# EAGLE design PCB-BI8-1x4SERCP_v08-16 (EAGLE 7.5.0)

## Sheet 1 of 2
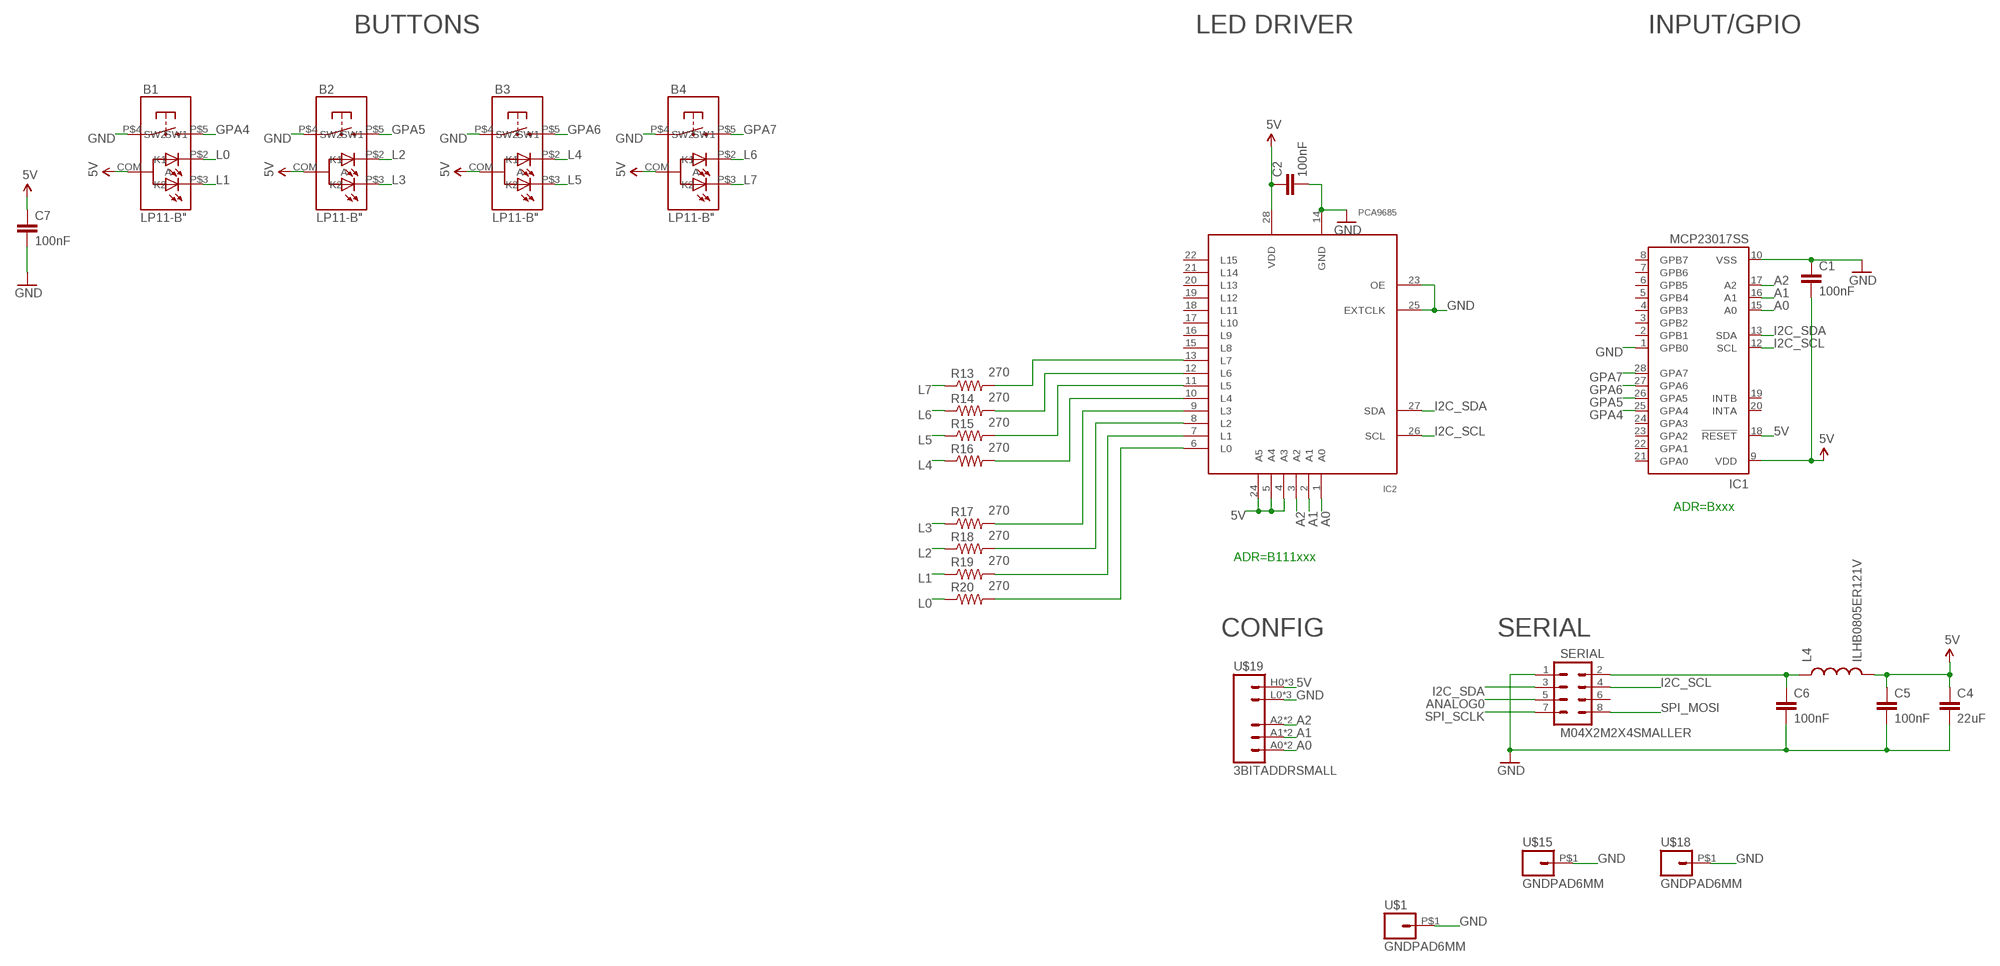
[diagram p0: schematic, sheet 1]

### Parts
B1  LP11-B"  [LP11]
B2  LP11-B"  [LP11]
B3  LP11-B"  [LP11]
B4  LP11-B"  [LP11]
C1  100nF  CAP0603-CAP  [0603-CAP]
C2  100nF  CAP0603-CAP  [0603-CAP]
C4  22uF  CAP0805  [0805]
C5  100nF  CAP0603-CAP  [0603-CAP]
C6  100nF  CAP0603-CAP  [0603-CAP]
C7  100nF  CAP0603-CAP  [0603-CAP]
IC1  MCP23017SS  [SSOP28]
IC2  PCA9685  [TSSOP28]
L4  ILHB0805ER121V  INDUCTOR0805  [0805]
R13  270  RESISTOR0603-RES  [0603-RES]
R14  270  RESISTOR0603-RES  [0603-RES]
R15  270  RESISTOR0603-RES  [0603-RES]
R16  270  RESISTOR0603-RES  [0603-RES]
R17  270  RESISTOR0603-RES  [0603-RES]
R18  270  RESISTOR0603-RES  [0603-RES]
R19  270  RESISTOR0603-RES  [0603-RES]
R20  270  RESISTOR0603-RES  [0603-RES]
SERIAL  M04X2M2X4SMALLER  [M2X4SMALLER]
U$1  GNDPAD6MM  [3.2MMPAD6MM]
U$15  GNDPAD6MM  [3.2MMPAD6MM]
U$18  GNDPAD6MM  [3.2MMPAD6MM]
U$19  3BITADDRSMALL  [3BITADDR_SMALL]

### Nets
5V [Power]: B1.COM(A) B2.COM(A) B3.COM(A) B4.COM(A) C1.2 C2.1 C4.1 C5.1 C7.1 IC1.9(VDD) IC1.18(!RESET) IC2.4(A3) IC2.5(A4) IC2.24(A5) IC2.28(VDD) L4.2 U$19.H0(VCC) U$19.H1(VCC) U$19.H2(VCC)
A0: IC1.15(A0) IC2.1(A0) U$19.A0 U$19.AS0(A0)
A1: IC1.16(A1) IC2.2(A1) U$19.A1 U$19.AS1(A1)
A2: IC1.17(A2) IC2.3(A2) U$19.A2 U$19.AS2(A2)
ANALOG0: SERIAL.5
GND [Power]: B1.P$4(SW1) B2.P$4(SW1) B3.P$4(SW1) B4.P$4(SW1) C1.1 C2.2 C4.2 C5.2 C6.2 C7.2 IC1.1(GPB0) IC1.10(VSS) IC2.14(GND) IC2.23(OE) IC2.25(EXTCLK) SERIAL.1 U$1.P$1 U$15.P$1 U$18.P$1 U$19.L0(GND) U$19.L1(GND) U$19.L2(GND)
GPA4: B1.P$5(SW2) IC1.25(GPA4)
GPA5: B2.P$5(SW2) IC1.26(GPA5)
GPA6: B3.P$5(SW2) IC1.27(GPA6)
GPA7: B4.P$5(SW2) IC1.28(GPA7)
I2C_SCL: IC1.12(SCL) IC2.26(SCL) SERIAL.4
I2C_SDA: IC1.13(SDA) IC2.27(SDA) SERIAL.3
L0: B1.P$2(K1) R20.1
L1: B1.P$3(K2) R19.1
L2: B2.P$2(K1) R18.1
L3: B2.P$3(K2) R17.1
L4: B3.P$2(K1) R16.1
L5: B3.P$3(K2) R15.1
L6: B4.P$2(K1) R14.1
L7: B4.P$3(K2) R13.1
N$1 [Power]: C6.1 L4.1 SERIAL.2
N$4: IC2.13(L7) R13.2
N$5: IC2.12(L6) R14.2
N$7: IC2.11(L5) R15.2
N$9: IC2.10(L4) R16.2
N$10: IC2.9(L3) R17.2
N$11: IC2.8(L2) R18.2
N$12: IC2.7(L1) R19.2
N$19: IC2.6(L0) R20.2
SPI_MOSI: SERIAL.8
SPI_SCLK: SERIAL.7
Unconnected: IC1.2(GPB1) IC1.3(GPB2) IC1.4(GPB3) IC1.5(GPB4) IC1.6(GPB5) IC1.7(GPB6) IC1.8(GPB7) IC1.19(INTB) IC1.20(INTA) IC1.21(GPA0) IC1.22(GPA1) IC1.23(GPA2) IC1.24(GPA3) IC2.15(L8) IC2.16(L9) IC2.17(L10) IC2.18(L11) IC2.19(L12) IC2.20(L13) IC2.21(L14) IC2.22(L15) SERIAL.6

### Notes on the sheet
- BUTTONS | LED DRIVER | INPUT/GPIO
- ADR=Bxxx
- ADR=B111xxx
- CONFIG | SERIAL

## Sheet 2 of 2

## Library data of the parts
B1-B4 = SKAARHOJ:LP11-B
C1 C2 C4-C7 = SparkFun:CAP: Capacitor Standard 0603 ceramic capacitor, and 0.1" leaded capacitor.
IC1 = microchip:MCP23017: http://ww1.microchip.com/downloads/en/DeviceDoc/21952a.pdf Source: http://ww1.microchip.com/downloads/en/DeviceDoc/21952a.pdf; MF: MICROCHIP; MPN: MCP23017-E/SS; OC_FARNELL: 1467674; OC_NEWARK: 31K2960
IC2 = wsmith:PCA9685
L4 = SparkFun:INDUCTOR: Inductors Basic Inductor/Choke - 0603 and 1206. Footprints are not proven and vary greatly between part numbers.
R13-R20 = SparkFun:RESISTOR: Resistor Basic schematic elements and footprints for 0603, 1206, and PTH resistors.
SERIAL = SKAARHOJ:M04X2
U$1 U$15 U$18 = SKAARHOJ:GNDPAD
U$19 = SKAARHOJ:3BITADDR

## Net classes
0 default: width 0.203 mm, drill 0.406 mm, clearance 0.203 mm
1 Power: width 0.406 mm, drill 0.61 mm, clearance 0.203 mm

## Board
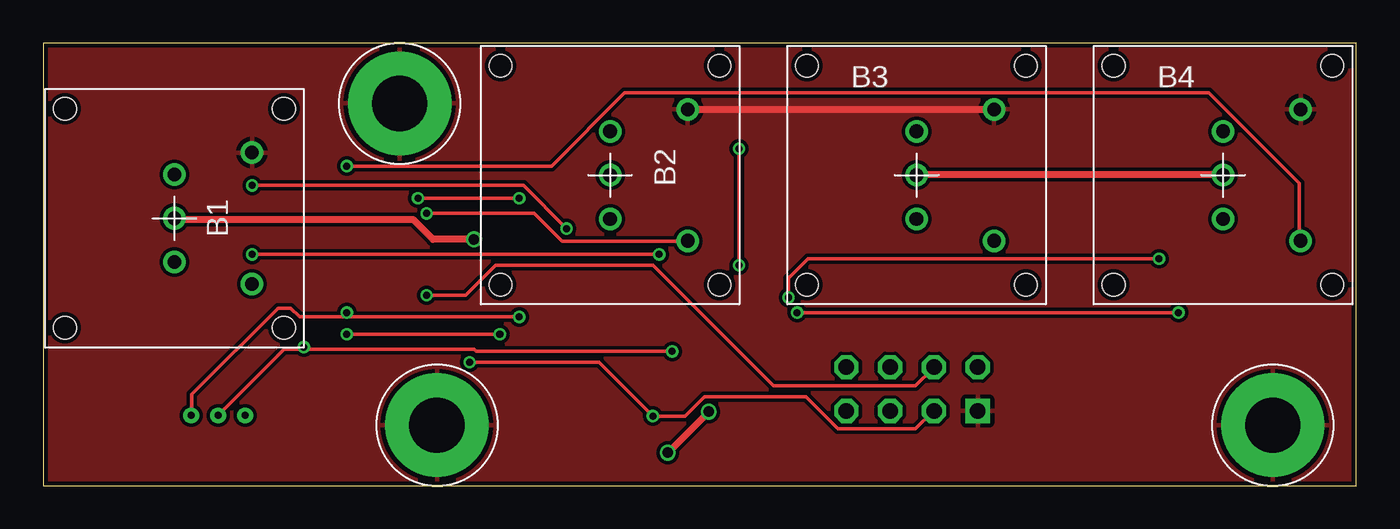
[diagram p1: board, top side]
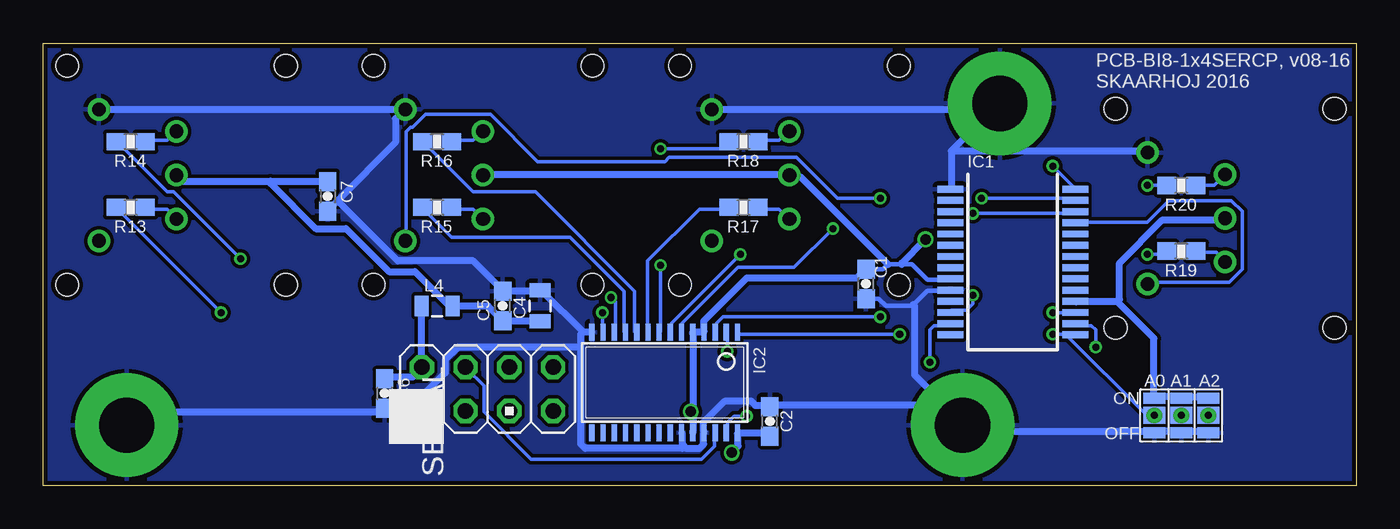
[diagram p2: board, bottom side, seen from below]

Size 76.2 x 25.66 mm. Coordinates in mm from the lower left corner, seen from the top.
Outline: 0,0 76.2,0 76.2,25.66 0,25.66 0,0
Copper layers (1*16): Top 0.035mm / dielectric 1.5mm / Bottom 0.035mm
Design rules "Fusion_eagle_rule_v1.1": minimum track width 6mil, minimum drill 12mil, track to track 6mil, track to pad 6mil, pad to pad 6mil, via to via 6mil, smd to smd 0mil, copper to edge 10mil, drill to drill 10mil, minimum pad ring 10mil, minimum via ring 6mil, stop-mask expansion 2mil, vias tented up to drill 100mil, thermal gap 10mil

### Footprints (pad centres in the part's own frame; a part is rotated, then mirrored left to right if it is on the bottom)
LP11 = drill 0.8: COM 0,0; P$2 0,2.54; P$3 0,-2.54; P$4 4.5,3.81; P$5 4.5,-3.81 | hole 1.3: -6.35,6.35; 6.35,6.35; 6.35,-6.35; -6.35,-6.35
0603-CAP = smd 1.1 x 1: 1 -0.85,0; 2 0.85,0
0805 = smd 0.8 x 1.2: 1 -0.9,0; 2 0.9,0
SSOP28 = smd 0.4 x 1.5: 1 -4.225,-3.625; 2 -3.575,-3.625; 3 -2.925,-3.625; 4 -2.275,-3.625; 5 -1.625,-3.625; 6 -0.975,-3.625; 7 -0.325,-3.625; 8 0.325,-3.625; 9 0.975,-3.625; 10 1.625,-3.625; 11 2.275,-3.625; 12 2.925,-3.625; 13 3.575,-3.625; 14 4.225,-3.625; 15 4.225,3.625; 16 3.575,3.625; 17 2.925,3.625; 18 2.275,3.625; 19 1.625,3.625; 20 0.975,3.625; 21 0.325,3.625; 22 -0.325,3.625; 23 -0.975,3.625; 24 -1.625,3.625; 25 -2.275,3.625; 26 -2.925,3.625; 27 -3.575,3.625; 28 -4.225,3.625
TSSOP28 = smd 0.305 x 0.991: 1 -4.225,-2.918; 2 -3.575,-2.918; 3 -2.925,-2.918; 4 -2.275,-2.918; 5 -1.625,-2.918; 6 -0.975,-2.918; 7 -0.325,-2.918; 8 0.325,-2.918; 9 0.975,-2.918; 10 1.625,-2.918; 11 2.275,-2.918; 12 2.925,-2.918; 13 3.575,-2.918; 14 4.225,-2.918; 15 4.225,2.918; 16 3.575,2.918; 17 2.925,2.918; 18 2.275,2.918; 19 1.625,2.918; 20 0.975,2.918; 21 0.325,2.918; 22 -0.325,2.918; 23 -0.975,2.918; 24 -1.625,2.918; 25 -2.275,2.918; 26 -2.925,2.918; 27 -3.575,2.918; 28 -4.225,2.918
0603-RES = smd 1.1 x 1: 1 -0.85,0; 2 0.85,0
M2X4SMALLER = drill 0.9 square: 1 -1.27,3.81 | drill 0.9 octagon: 2 1.27,3.81; 3 -1.27,1.27; 4 1.27,1.27; 5 -1.27,-1.27; 6 1.27,-1.27; 7 -1.27,-3.81; 8 1.27,-3.81
3.2MMPAD6MM = drill 3.2 pad 6: P$1 0,0
3BITADDR_SMALL = drill 0.4: A0 -1.565,0; A1 0,0; A2 1.565,0 | smd 1.27 x 1: AS0 -1.565,0; AS1 0,0; AS2 1.565,0 | smd 1.27 x 0.635: H0 -1.565,1; H1 0,1; H2 1.565,1; L0 -1.565,-1; L1 0,-1; L2 1.565,-1

### Placement (x,y rotation side)
B1  7.62,15.5 0 top
B2  32.9,18 0 top
B3  50.68,18 0 top
B4  68.46,18 0 top
C1  28.45,11.69 90 bottom
C2  34.04,3.71 90 bottom
C4  47.37,10.42 90 bottom
C5  49.53,10.42 90 bottom
C6  56.39,5.34 270 bottom
C7  59.69,16.77 270 bottom
IC1  19.94,12.96 270 bottom
IC2  40.13,5.98 180 bottom
L4  53.34,10.42 0 bottom
R13  71.12,16.14 180 bottom
R14  71.12,19.95 180 bottom
R15  53.34,16.14 180 bottom
R16  53.34,19.95 180 bottom
R17  35.56,16.14 180 bottom
R18  35.56,19.95 180 bottom
R19  10.16,13.59 180 bottom
R20  10.16,17.41 180 bottom
SERIAL  50.42,5.59 90 bottom
U$1  20.69,22.16 0 top
U$15  22.85,3.5 0 top
U$18  71.35,3.5 0 top
U$19  10.16,4.07 0 bottom

### Tracks (layer width: path | path; a pad name or v marks a point on that pad's centre or on a via)
5V  (via drill 0.61)
  Top 0.406: B3.COM 50.75,18.03 68.38,18.03 B4.COM | v38.62,4.28 v36.25,1.91 | v25,14.28 22.62,14.28 21.5,15.4 7.62,15.4 B1.COM
  Bottom 0.254: C1.2 27.47,12.54 27.18,12.83 26.38,12.83 25.78,12.83 24.89,11.94 23.61,11.94 IC1.9
  Bottom 0.406: C4.1 49.5,9.53 C5.1 49.62,9.65 50.38,10.4 52.38,10.4 L4.2 52.62,10.4 54.62,12.4 56.12,12.4 58.62,14.9 60.38,14.9 63,17.53 63,17.66 | 63,17.66 68.12,17.66 68.38,17.91 B4.COM | 63,17.66 59.75,17.66 C7.1 | U$19.H2 8.62,5.16 10.12,5.16 U$19.H1 10.25,5.16 11.62,5.16 U$19.H0 11.75,5.28 11.75,8.53 13.88,10.65 | 13.88,10.65 16.25,10.65 IC1.18 | B1.COM 7.62,15.4 11.25,15.4 13.75,12.9 13.75,10.78 13.88,10.65 | C2.1 34.12,2.91 34.25,3.03 35.88,3.03 IC2.28 35.88,2.91 35.88,2.28 v36.25,1.91 | 38.5,4.28 38.5,8.78 IC2.5 38.38,8.9 37.88,8.9 IC2.4 37.88,9.03 37.88,9.53 35.38,12.03 29,12.03 28.5,12.53 C1.2 | 38.5,4.28 38.5,3.16 IC2.24 | v38.62,4.28 38.5,4.28 | 27.18,12.83 32.25,17.91 32.88,17.91 B2.COM 33,18.03 50.62,18.03 B3.COM | v25,14.28 26.38,12.9 26.38,12.83
A0  (via drill 0.41)
  Top 0.203: v17.62,8.78 v26.5,8.78
  Bottom 0.203: 11.75,4.03 U$19.AS0 11.75,4.16 12.25,4.16 16.88,8.78 | v26.5,8.78 35.88,8.78 IC2.1 | 16.88,8.78 16.38,8.78 IC1.15 16.88,8.78 | 16.88,8.78 v17.62,8.78
A1  (via drill 0.41)
  Top 0.203: v36.5,7.78 25.12,7.78 25,7.91 15.12,7.91 | 15.12,7.91 14,7.91 10.25,4.16 U$19.AS1 | 15.12,7.91 v15.12,8.03
  Bottom 0.203: v36.5,7.78 36.5,8.78 IC2.2 | 10.25,4.03 U$19.AS1 | v15.12,8.03 15.12,9.03 15.38,9.28 16.25,9.28 IC1.16
A2  (via drill 0.41)
  Top 0.203: 17.62,9.78 14.88,9.78 14.38,10.28 13.62,10.28 8.62,5.28 8.62,4.16 U$19.AS2 | 17.62,9.78 v27.62,9.78 | 17.62,9.78 v17.62,10.03
  Bottom 0.203: v27.62,9.78 36.75,9.78 37.12,9.4 37.12,8.9 IC2.3 | 8.62,4.03 U$19.AS2 | v17.62,10.03 16.38,10.03 IC1.17
GND
  Top 0.406: B2.P$4 37.5,21.78 55.12,21.78 B3.P$4
  Bottom 0.254: C1.1 27.73,10.84 27.3,10.42 25.78,10.42 25.71,10.49 24.89,11.31 23.59,11.31 IC1.10
  Bottom 0.406: 23.38,19.53 20.75,22.16 U$1.P$1 21.38,21.78 37.38,21.78 B2.P$4 | 23.38,19.53 23.5,19.41 23.5,17.28 IC1.1 | B1.P$4 12.12,19.41 23.25,19.41 23.38,19.53 | U$18.P$1 71.25,3.53 70.5,4.28 56.5,4.28 C6.2 56.38,4.41 54.25,4.41 SERIAL.1 54.12,4.53 54.12,5.28 52.88,6.53 52.88,7.28 52.12,8.03 45,8.03 | 59.12,16.53 55.75,19.91 55.75,21.28 55.25,21.78 B3.P$4 55.5,21.78 72.88,21.78 B4.P$4 | 59.12,16.53 59.62,16.03 C7.2 | 44.88,8.9 44.38,8.9 IC2.14 | 44.88,8.9 47.25,11.28 C4.2 47.5,11.28 49.5,11.28 C5.2 49.62,11.4 51.25,13.03 55.62,13.03 59.12,16.53 | 39,2.28 39.12,2.41 39.12,3.03 IC2.23 | 39,2.28 38.88,2.16 38.12,2.16 37.88,2.41 37.88,3.03 IC2.25 37.88,3.16 37.88,3.66 36.62,4.91 35.12,4.91 34.88,4.66 34.12,4.66 C2.2 33.88,4.66 24.12,4.66 U$15.P$1 | U$19.L2 8.62,3.16 10.12,3.16 U$19.L1 10.25,3.16 11.62,3.16 U$19.L0 11.88,3.16 22.5,3.16 22.75,3.41 U$15.P$1 | 25.71,10.49 25.62,10.4 25.62,6.41 22.88,3.66 U$15.P$1 | 45,8.03 45,2.41 44.75,2.16 39.12,2.16 39,2.28 | 45,8.03 45,8.78 44.88,8.9
  pour Top: 0,0.26 76.2,0.26 76.2,25.66 0,25.66
  pour Bottom: 0,0.26 76.2,0.26 76.2,25.66 0,25.66
GPA4
  Bottom 0.203: IC1.25 16.25,15.28 12.12,15.28 10.88,16.53 7.25,16.53 6.62,15.9 6.62,12.53 7.38,11.78 12,11.78 B1.P$5
GPA5  (via drill 0.41)
  Top 0.203: v22.25,15.78 28.5,15.78 30.12,14.15 37.38,14.15 B2.P$5
  Bottom 0.203: v22.25,15.78 16.38,15.78 IC1.26
GPA6  (via drill 0.41)
  Top 0.203: v27.62,16.66 v21.75,16.66
  Bottom 0.203: v21.75,16.66 16.38,16.66 IC1.27 | v27.62,16.66 30.12,16.66 32.5,19.03 39.88,19.03 40.12,18.78 47.5,18.78 50.25,21.53 54,21.53 54.75,20.78 54.88,20.78 55.12,20.53 55.12,14.28 B3.P$5
GPA7  (via drill 0.41)
  Top 0.203: v17.62,18.53 29.5,18.53 33.75,22.78 67.62,22.78 72.88,17.53 72.88,14.28 B4.P$5
  Bottom 0.203: v17.62,18.53 16.38,17.28 IC1.28
I2C_SCL  (via drill 0.41)
  Top 0.203: v22.25,11.03 24.5,11.03 26.25,12.78 35.38,12.78 42.38,5.78 50.62,5.78 51.62,6.78 SERIAL.4
  Bottom 0.203: IC2.26 37.25,3.03 37.25,2.28 38,1.53 47.88,1.53 50.62,4.28 50.62,5.78 51.62,6.78 SERIAL.4 | v22.25,11.03 22.25,10.53 22.62,10.15 23.5,10.15 IC1.12
I2C_SDA  (via drill 0.41)
  Top 0.203: SERIAL.3 51.62,4.28 50.62,3.28 46.12,3.28 44.25,5.16 38.38,5.16 37.25,4.03 v35.38,4.03 32.25,7.16 v24.75,7.16
  Bottom 0.203: v35.38,4.03 36.12,4.03 36.5,3.66 36.5,3.16 IC2.27 | v24.75,7.16 24.75,9.03 24.5,9.28 23.62,9.28 IC1.13
L0
  Bottom 0.203: R20.1 8.25,17.41 B1.P$2
L1
  Bottom 0.203: R19.1 9.25,13.53 8.12,13.53 7.62,13.03 B1.P$3
L2
  Bottom 0.203: R18.1 34.62,20.03 33.5,20.03 33,20.53 B2.P$2
L3
  Bottom 0.203: R17.1 34.62,16.03 33.5,16.03 33,15.53 B2.P$3
L4
  Bottom 0.203: R16.1 52.38,20.03 51.25,20.03 50.75,20.53 B3.P$2
L5
  Bottom 0.203: B3.P$3 51.25,16.03 52.38,16.03 R15.1
L6
  Bottom 0.203: R14.1 70.25,20.03 69,20.03 68.5,20.53 B4.P$2
L7
  Bottom 0.203: R13.1 70.25,16.03 69,16.03 68.5,15.53 B4.P$3
N$1
  Bottom 0.406: C6.1 56.38,6.28 54.75,6.28 54.25,6.78 SERIAL.2 54.25,7.03 54.25,10.4 L4.1
N$4  (via drill 0.41)
  Top 0.203: v65.88,10.03 v43.75,10.03
  Bottom 0.203: v43.75,10.03 43.75,8.9 IC2.13 | v65.88,10.03 71.88,16.03 R13.2
N$5  (via drill 0.41)
  Top 0.203: v43.25,10.9 43.25,12.03 44.38,13.15 v64.75,13.15
  Bottom 0.203: v43.25,10.9 43,10.65 43,8.9 IC2.12 | v64.75,13.15 68.62,17.03 69,17.03 71.88,19.91 R14.2
N$7
  Bottom 0.203: IC2.11 42.5,8.9 42.5,11.28 45.62,14.4 52.5,14.4 54.12,16.03 R15.2
N$9
  Bottom 0.203: IC2.10 41.88,8.9 41.88,11.28 47.62,17.03 51.25,17.03 54.12,19.91 R16.2
N$10
  Bottom 0.203: IC2.9 41.12,8.9 41.12,13.03 38.12,16.03 36.5,16.03 R17.2
N$11  (via drill 0.41)
  Top 0.203: v40.38,19.53 v40.38,12.78
  Bottom 0.203: v40.38,12.78 40.38,8.9 IC2.8 | v40.38,19.53 36.88,19.53 36.5,19.91 R18.2
N$12  (via drill 0.41)
  Top 0.203: v12.12,13.4 v35.75,13.4
  Bottom 0.203: v35.75,13.4 39.75,9.4 39.75,8.9 IC2.7 | v12.12,13.4 11.25,13.4 11.12,13.53 R19.2
N$19  (via drill 0.41)
  Top 0.203: v30.38,14.9 27.88,17.41 v12.12,17.41
  Bottom 0.203: v30.38,14.9 32.62,12.65 35.88,12.65 39.12,9.4 39.12,8.9 IC2.6 | R20.2 v12.12,17.41

### Text on the board
_bsilk: PCB-BI8-1x4SERCP, v08-16 / SKAARHOJ 2016